# Altium schematic sheet Top.SchDoc
size A4; SheetNumber: 1; SheetTotal: 6
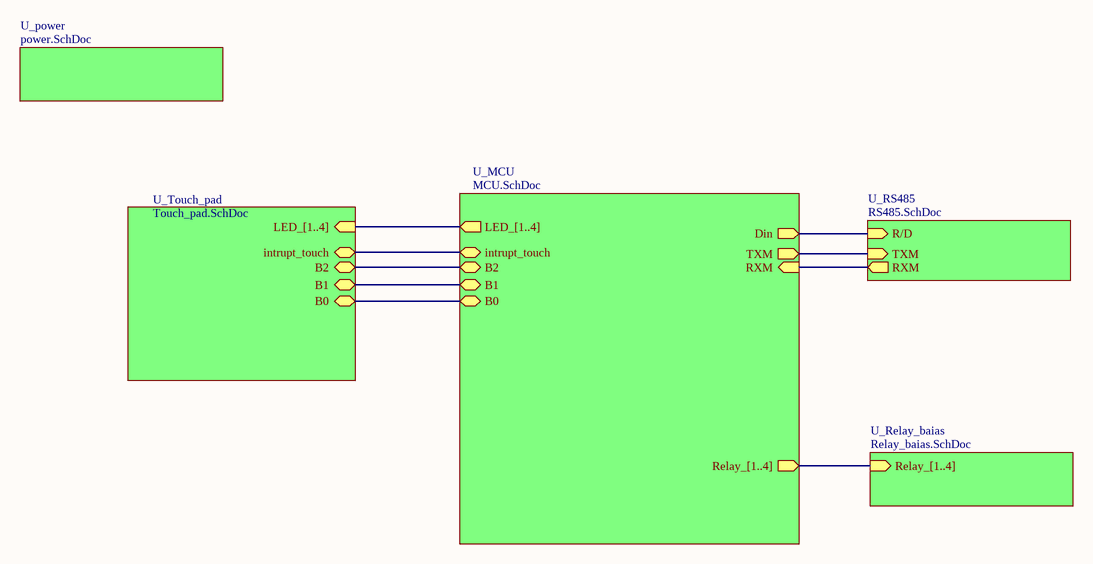
[diagram p0: Top.SchDoc]

## Sub-sheets
U_MCU = MCU.SchDoc: LED_[1..4] (out), Din (out), Relay_[1..4] (out), B1 (bidir), B0 (bidir), B2 (bidir), TXM (out), RXM (in), intrupt_touch (bidir)
U_power = power.SchDoc: no entries
U_Relay_baias = Relay_baias.SchDoc: Relay_[1..4] (in)
U_RS485 = RS485.SchDoc: TXM (in), R/D (in), RXM (out)
U_Touch_pad = Touch_pad.SchDoc: LED_[1..4] (in), B2 (bidir), B0 (bidir), B1 (bidir), intrupt_touch (bidir)

## Nets
(unnamed): sheet U_MCU/Din, sheet U_RS485/R/D
(unnamed): sheet U_MCU/B1, sheet U_Touch_pad/B1
(unnamed): sheet U_MCU/B0, sheet U_Touch_pad/B0
(unnamed): sheet U_MCU/B2, sheet U_Touch_pad/B2
(unnamed): sheet U_MCU/TXM, sheet U_RS485/TXM
(unnamed): sheet U_MCU/RXM, sheet U_RS485/RXM
(unnamed): sheet U_MCU/intrupt_touch, sheet U_Touch_pad/intrupt_touch

## Buses and harness runs
bus sheet U_MCU/LED_[1..4] = sheet U_Touch_pad/LED_[1..4]
bus sheet U_MCU/Relay_[1..4] = sheet U_Relay_baias/Relay_[1..4]